# EAGLE design logger066_4ch_16APR12 (EAGLE 5.11)
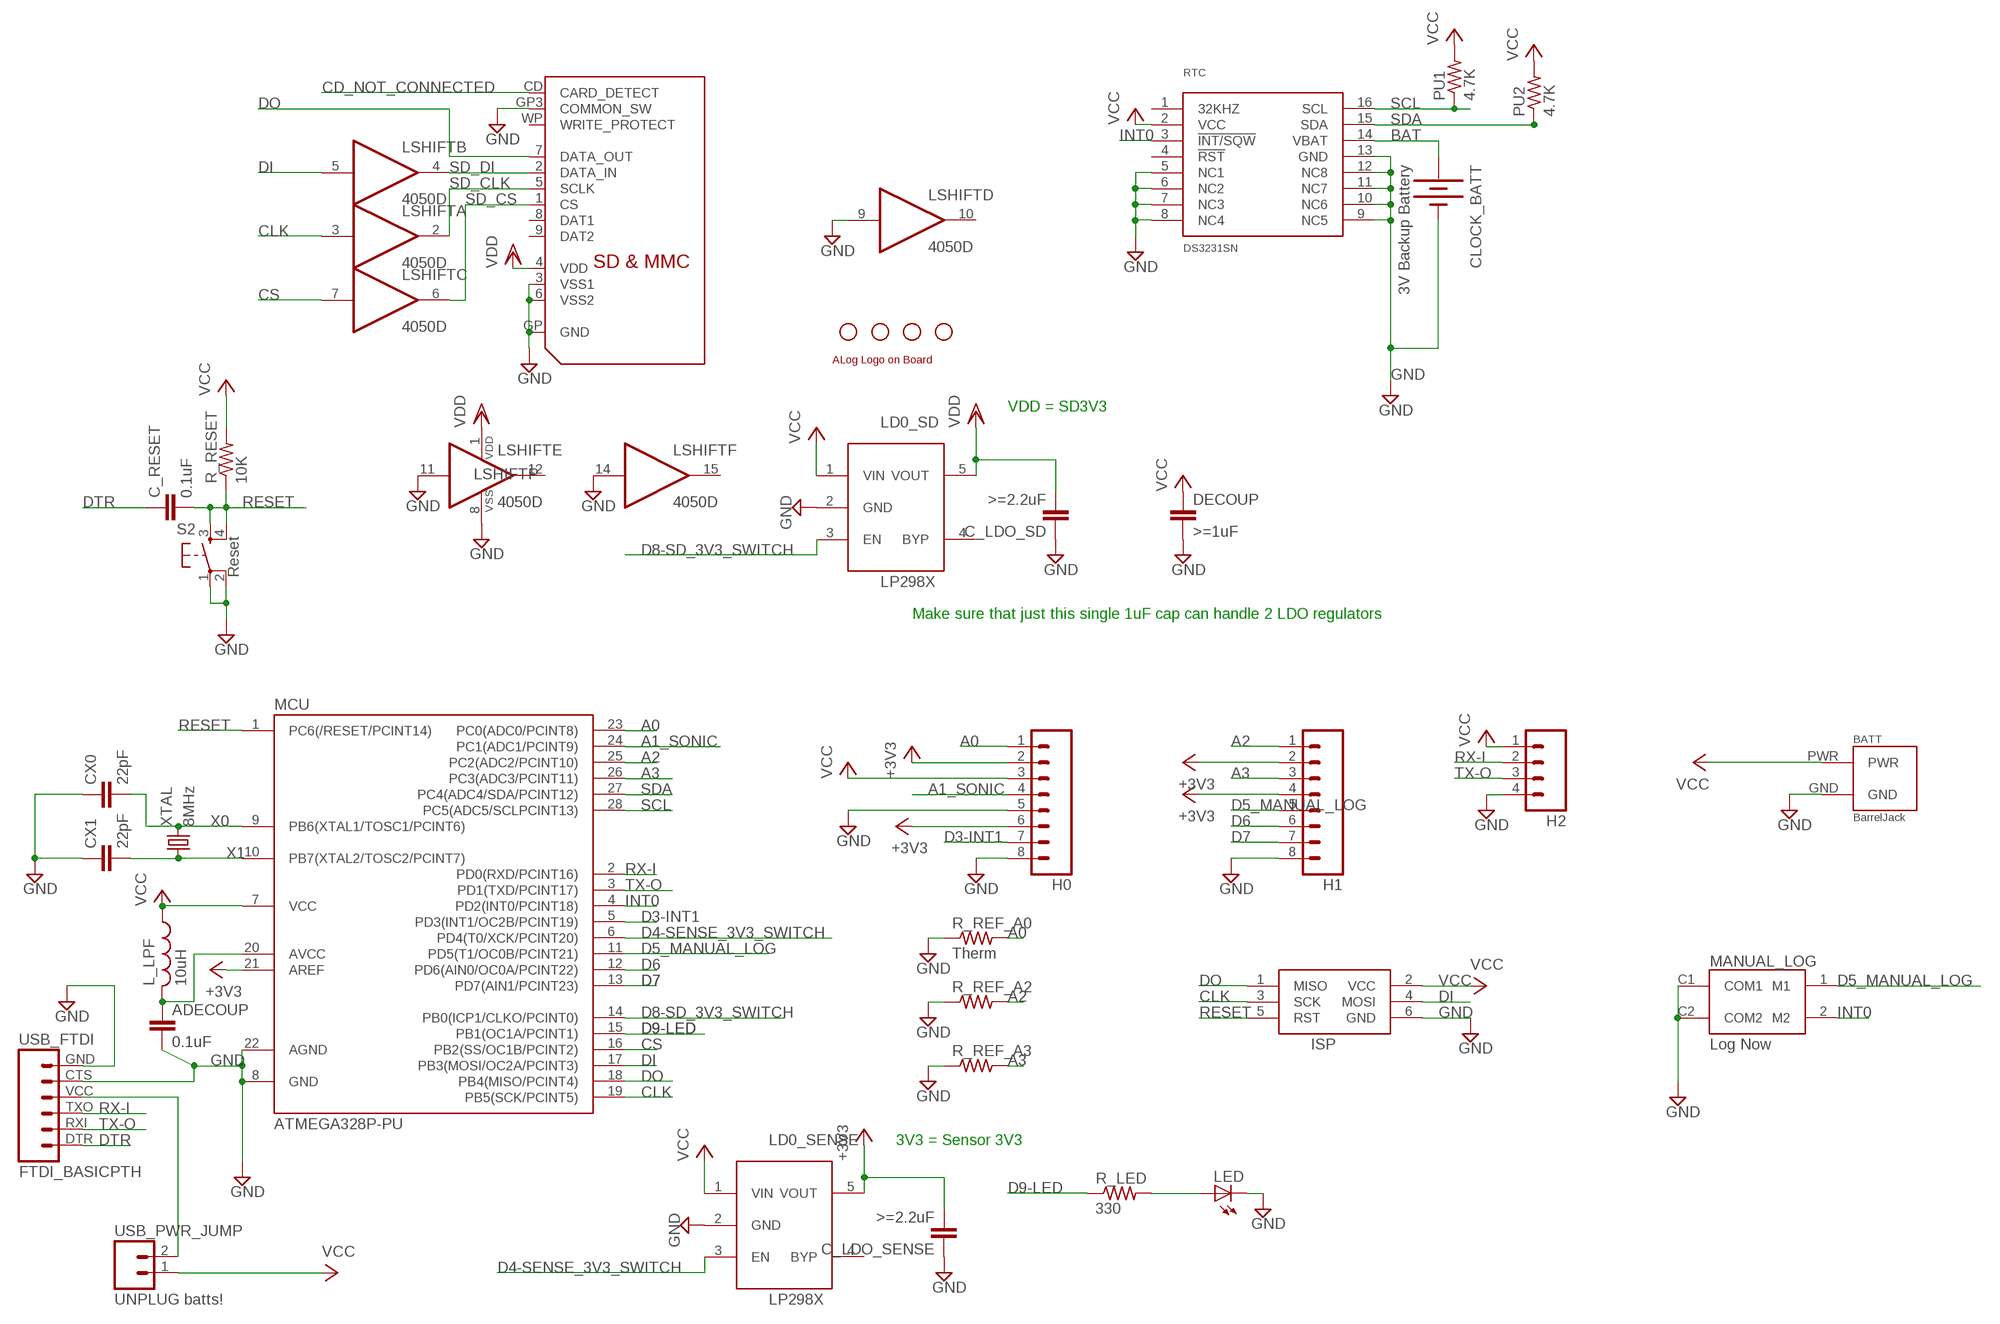
[diagram p0: schematic, sheet 1]

## Parts
ADECOUP  0.1uF  CAPPTH  [CAP-PTH-SMALL]
BATT  BarrelJack  BARREL_JACK_2.5_5.5_MM_CONN  [PJ-037B]
C_LDO_SD  >=2.2uF  CAPPTH  [CAP-PTH-SMALL]
C_LDO_SENSE  >=2.2uF  CAPPTH  [CAP-PTH-SMALL]
C_RESET  0.1uF  CAPPTH  [CAP-PTH-SMALL]
CLOCK_BATT  3V Backup Battery  BATTERY12PTH  [BATTCON_12MM_PTH]
CX0  22pF  CAPPTH  [CAP-PTH-SMALL]
CX1  22pF  CAPPTH  [CAP-PTH-SMALL]
DECOUP  >=1uF  CAPPTH  [CAP-PTH-SMALL]
H0  M083.5MM-8  [SCREWTERMINAL-3.5MM-8]
H1  M083.5MM-8  [SCREWTERMINAL-3.5MM-8]
H2  M04SCREW  [SCREWTERMINAL-3.5MM-4]
ISP  AVRISP-6  [AVRISP]
JP1  STAND-OFF  [STAND-OFF]
JP2  STAND-OFF  [STAND-OFF]
JP3  STAND-OFF  [STAND-OFF]
JP4  STAND-OFF  [STAND-OFF]
L_LPF  10uH  L-US0207/12  [0207/12]
LD0_SD  LP2985  LP298XS  [SOT23-5L]
LD0_SENSE  LP2985  LP298XS  [SOT23-5L]
LED  LED3MM  [LED3MM]
LSHIFT  4050D  [SO16]
MANUAL_LOG  Log Now  TL3350'TL3350'  [TL_BUTTON]
MCU  ATMEGA328P-PU  MEGA48/88/168-PU  [DIL28-3]
PU1  4.7K  R-US_0204/5  [0204/5]
PU2  4.7K  R-US_0204/5  [0204/5]
R_LED  330  R-US_0204/5  [0204/5]
R_REF_A0  Therm  R-US_0207/10  [0207/10]
R_REF_A2  R-US_0207/10  [0207/10]
R_REF_A3  R-US_0207/10  [0207/10]
R_RESET  10K  R-US_0204/5  [0204/5]
RTC  DS3231SN  [SO16W]
S2  Reset  TAC_SWITCHSND  [TACTILE_SWITCH_SMD]
SD  SDMMC06132  [06132]
U$2  ALOG_LOGO_V0_5.5MM  [ALOG_LOGO_V0_SMALL]
USB_FTDI  FTDI_BASICPTH  [FTDI_BASIC]
USB_PWR_JUMP  UNPLUG batts!  M02LOCK  [1X02_LOCK]
XTAL  8MHz  CRYSTALHC49UV  [HC49U-V]

## Nets
+3V3: C_LDO_SENSE.2 H0.2 H0.6 H1.2 H1.4 LD0_SENSE.5(VOUT) MCU.21(AREF)
A0: H0.1 MCU.23(PC0(ADC0/PCINT8)) R_REF_A0.2
A1_SONIC: H0.4 MCU.24(PC1(ADC1/PCINT9))
A2: H1.1 MCU.25(PC2(ADC2/PCINT10)) R_REF_A2.2
A3: H1.3 MCU.26(PC3(ADC3/PCINT11)) R_REF_A3.2
BAT: CLOCK_BATT.VCC@1(+) RTC.14(VBAT)
CD_NOT_CONNECTED: SD.CD(CARD_DETECT)
CLK: ISP.3(SCK) LSHIFT.3(A:I) MCU.19(PB5(SCK/PCINT5))
CS: LSHIFT.7(C:I) MCU.16(PB2(SS/OC1B/PCINT2))
D3-INT1: H0.7 MCU.5(PD3(INT1/OC2B/PCINT19))
D4-SENSE_3V3_SWITCH: LD0_SENSE.3(EN) MCU.6(PD4(T0/XCK/PCINT20))
D5_MANUAL_LOG: H1.5 MANUAL_LOG.1(M1) MCU.11(PD5(T1/OC0B/PCINT21))
D6: H1.6 MCU.12(PD6(AIN0/OC0A/PCINT22))
D7: H1.7 MCU.13(PD7(AIN1/PCINT23))
D8-SD_3V3_SWITCH: LD0_SD.3(EN) MCU.14(PB0(ICP1/CLKO/PCINT0))
D9-LED: MCU.15(PB1(OC1A/PCINT1)) R_LED.1
DI: ISP.4(MOSI) LSHIFT.5(B:I) MCU.17(PB3(MOSI/OC2A/PCINT3))
DO: ISP.1(MISO) MCU.18(PB4(MISO/PCINT4)) SD.7(DATA_OUT)
DTR: C_RESET.1 USB_FTDI.DTR
GND: ADECOUP.2 BATT.GND C_LDO_SD.1 C_LDO_SENSE.1 CLOCK_BATT.GND(-) CX0.1 CX1.1 DECOUP.2 H0.5 H0.8 H1.8 H2.4 ISP.6(GND) LD0_SD.2(GND) LD0_SENSE.2(GND) LED.K(C) LSHIFT.8(P:VSS) LSHIFT.9(D:I) LSHIFT.11(E:I) LSHIFT.14(F:I) MANUAL_LOG.C1(COM1) MANUAL_LOG.C2(COM2) MCU.8(GND) MCU.22(AGND) R_REF_A0.1 R_REF_A2.1 R_REF_A3.1 RTC.5(NC1) RTC.6(NC2) RTC.7(NC3) RTC.8(NC4) RTC.9(NC5) RTC.10(NC6) RTC.11(NC7) RTC.12(NC8) RTC.13(GND) S2.1 S2.2 SD.3(VSS1) SD.6(VSS2) SD.GP3(COMMON_SW) SD.GP(GND) USB_FTDI.CTS USB_FTDI.GND
INT0: MANUAL_LOG.2(M2) MCU.4(PD2(INT0/PCINT18)) RTC.3(!INT/SQW)
LED+: LED.A R_LED.2
N$1: USB_FTDI.VCC USB_PWR_JUMP.2
N$2: ADECOUP.1 L_LPF.2 MCU.20(AVCC)
RESET: C_RESET.2 ISP.5(RST) MCU.1(PC6(/RESET/PCINT14)) R_RESET.1 S2.3 S2.4
RX-I: H2.2 MCU.2(PD0(RXD/PCINT16)) USB_FTDI.TXO
SCL: MCU.28(PC5(ADC5/SCLPCINT13)) PU1.1 RTC.16(SCL)
SD_CLK: LSHIFT.2(A:O) SD.5(SCLK)
SD_CS: LSHIFT.6(C:O) SD.1(CS)
SD_DI: LSHIFT.4(B:O) SD.2(DATA_IN)
SDA: MCU.27(PC4(ADC4/SDA/PCINT12)) PU2.1 RTC.15(SDA)
TX-O: H2.3 MCU.3(PD1(TXD/PCINT17)) USB_FTDI.RXI
VCC: BATT.PWR DECOUP.1 H0.3 H2.1 ISP.2(VCC) L_LPF.1 LD0_SD.1(VIN) LD0_SENSE.1(VIN) MCU.7(VCC) PU1.2 PU2.2 R_RESET.2 RTC.2(VCC) USB_PWR_JUMP.1
VDD: C_LDO_SD.2 LD0_SD.5(VOUT) LSHIFT.1(P:VDD) SD.4(VDD)
X0: CX0.2 MCU.9(PB6(XTAL1/TOSC1/PCINT6)) XTAL.2
X1: CX1.2 MCU.10(PB7(XTAL2/TOSC2/PCINT7)) XTAL.1
Unconnected: LD0_SD.4(BYP) LD0_SENSE.4(BYP) LSHIFT.10(D:O) LSHIFT.12(E:O) LSHIFT.15(F:O) RTC.1(32KHZ) RTC.4(!RST) SD.8(DAT1) SD.9(DAT2) SD.WP(WRITE_PROTECT)

## Notes on the sheet
- VDD = SD3V3
- Make sure that just this single 1uF cap can handle 2 LDO regulators
- 3V3 = Sensor 3V3

## Library data of the parts
ADECOUP C_LDO_SD C_LDO_SENSE C_RESET CX0 CX1 DECOUP = SparkFun:CAP: Capacitor Standard 0603 ceramic capacitor, and 0.1" leaded capacitor.
BATT = awickert:BARREL_JACK_2.5_5.5_MM_CONN: Barrel Jack PJ-037B 2.5 mm ID, 6.5 mm OD Connects to plug with 2.5mm ID, 5.5mm OD Digi-Key CP-037B-ND
CLOCK_BATT = SparkFun:BATTERY: Battery Holders Various common sizes : AA, AAA, 20mm coin cell and 12mm coin cell.
H0 H1 = SparkFun:M08: Header 8 Standard 8-pin 0.1" header. Use with straight break away headers (SKU : PRT-00116), right angle break away headers (PRT-00553), swiss pins (PRT-00743), machine pins (PRT-00117), and female headers (PRT-00115).
H2 = SparkFun:M04: Header 4 Standard 4-pin 0.1" header. Use with straight break away headers (SKU : PRT-00116), right angle break away headers (PRT-00553), swiss pins (PRT-00743), machine pins (PRT-00117), and female headers (PRT-00115). Molex polarized connector foot print use with SKU : PRT-08231 with associated crimp pins and housings. 1MM SMD Version SKU: PRT-10208
ISP = adafruit:AVRISP: AVR ISP HEADER Standard 6 pin header for AVR programming
JP1-JP4 = SparkFun:STAND-OFF: Stand Off This is the mechanical footprint for a #4 phillips button head screw. Use the keepout ring to avoid running the screw head into surrounding components. SKU : PRT-00447
L_LPF = rcl:L-US: INDUCTOR, American symbol
LD0_SD LD0_SENSE = adafruit:LP298X
LED = SparkFun:LED: LEDs Standard schematic elements and footprints for 5mm, 3mm, 1206, and 0603 sized LEDs. 5mm - Spark Fun Electronics SKU : COM-00529 (and others)
LSHIFT = 40xx:4050: Hex non-inverting BUFFER
MANUAL_LOG = awickert:TL3350: Dual action (half- and full-press) button: COM1 and COM2 are connected internally. Pin 1 connects to COM1 on a half-press, and both connect on a full press.
MCU = avr-4:MEGA48/88/168-PU
PU1 PU2 R_LED R_REF_A0 R_REF_A2 R_REF_A3 R_RESET = resistor:R-US_: RESISTOR, American symbol
RTC = comfile:DS3231SN
S2 = SparkFun:TAC_SWITCH: Momentary Switch Button commonly used for reset or general input. Spark Fun Electronics SKU : COM-00097
SD = adafruit:SDMMC: SD MMC Card holder 4UCON part #06132 - easy to solder
U$2 = awickert:ALOG_LOGO_V0_5.5MM
USB_FTDI = SparkFun:FTDI_BASIC: FTDI Basic: 3.3V and 5V
USB_PWR_JUMP = SparkFun:M02: Header 2 Standard 2-pin 0.1" header. Use with straight break away headers (SKU : PRT-00116), right angle break away headers (PRT-00553), swiss pins (PRT-00743), machine pins (PRT-00117), and female headers (PRT-00115). Molex polarized connector foot print use with SKU : PRT-08233 with associated crimp pins and housings.
XTAL = SparkFun:CRYSTAL: Crystals Various standard crystals. Proven footprints. Spark Fun Electronics SKU : COM-00534

## Board
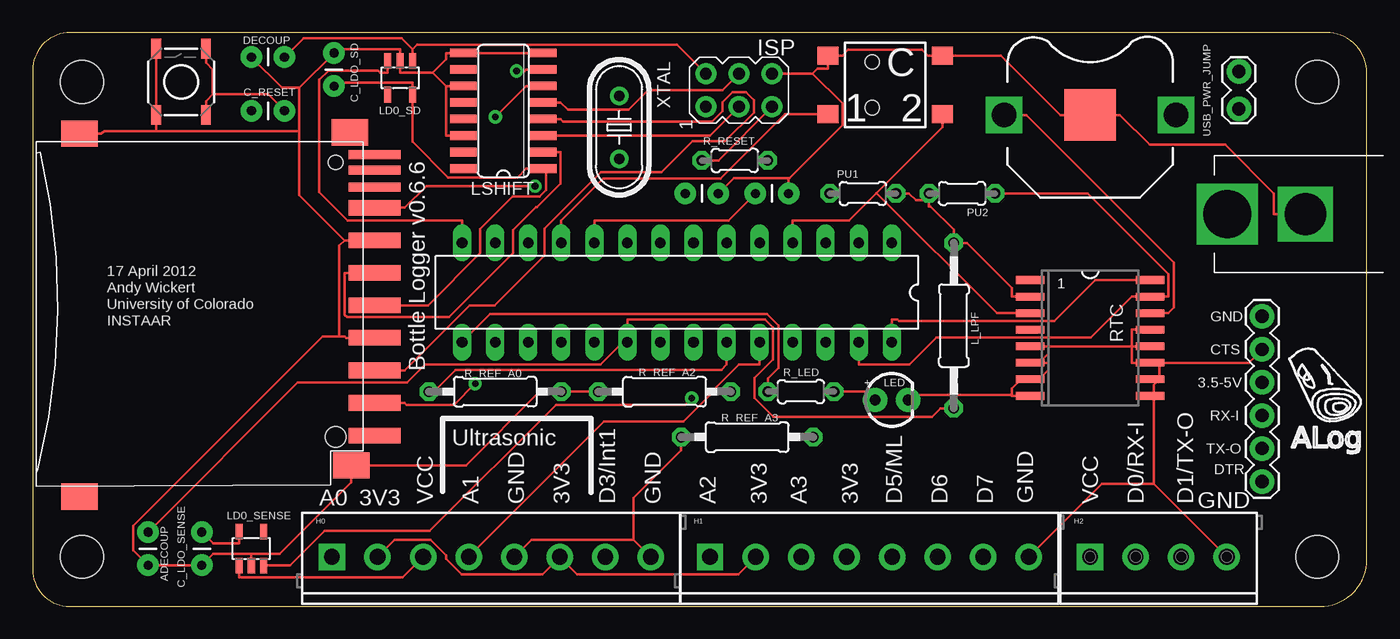
[diagram p1: board, top side]
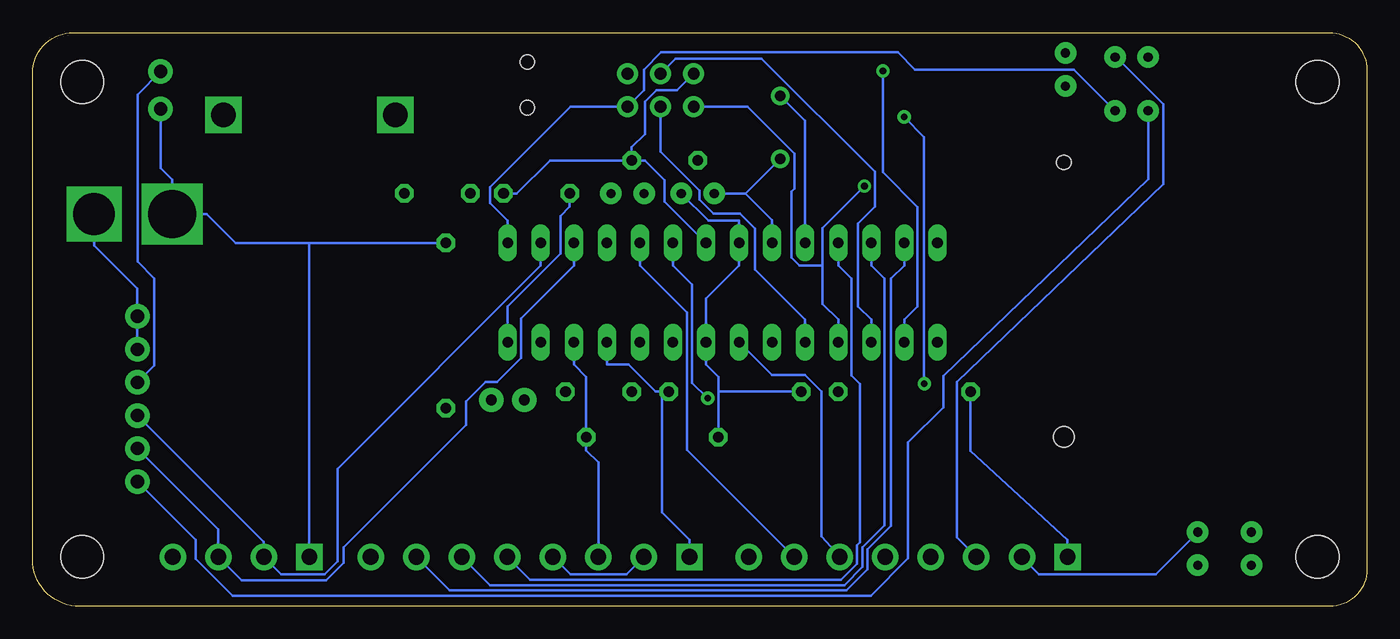
[diagram p2: board, bottom side, seen from below]

Size 102.54 x 44.12 mm. Coordinates in mm from the lower left corner, seen from the top.
Outline: 102.54,41 arc90 99.42,44.12 2.91,44.12 arc90 0,41.21 0,2.85 arc90 2.85,0 98.92,0 arc90 102.54,3.62 102.54,41
Copper layers (1*16): Top 0.035mm / dielectric 1.5mm / Bottom 0.035mm
Design rules "SparkFun": minimum track width 8mil, minimum drill 20mil, track to track 8mil, track to pad 8mil, pad to pad 8mil, via to via 8mil, smd to smd 8mil, copper to edge 10mil, drill to drill 8mil, minimum pad ring 12mil, minimum via ring 10mil, stop-mask expansion 4mil, vias tented up to drill 25mil, thermal gap 10mil

### Footprints (pad centres in the part's own frame; a part is rotated, then mirrored left to right if it is on the bottom)
CAP-PTH-SMALL = drill 0.7 pad 1.651 round: 1 0,0; 2 2.54,0
PJ-037B = drill 3.2 square: GND 6,0 | drill 3.7 square: PWR 12,0
BATTCON_12MM_PTH = smd 3.962 x 3.962: GND 0,0 | drill 1.854 square: VCC@1 -6.604,0; VCC@2 6.604,0
SCREWTERMINAL-3.5MM-8 = drill 1.2 pad 2.032 square: 1 0,0 | drill 1.2 pad 2.032 round: 2 3.5,0; 3 7,0; 4 10.5,0; 5 14,0; 6 17.5,0; 7 21,0; 8 24.5,0
SCREWTERMINAL-3.5MM-4 = drill 1.2 pad 2.032 square: 1 0,0 | drill 1.2 pad 2.032 round: 2 3.5,0; 3 7,0; 4 10.5,0
AVRISP = drill 0.9 pad 1.626 round: 1 -1.27,2.54; 2 1.27,2.54; 3 -1.27,0; 4 1.27,0; 5 -1.27,-2.54; 6 1.27,-2.54
STAND-OFF = hole 3.302: 0,0
0207/12 = drill 0.813 octagon: 1 -6.35,0; 2 6.35,0
SOT23-5L = smd 0.55 x 1.2: 1 -0.95,-1.3; 2 0,-1.3; 3 0.95,-1.3; 4 0.95,1.3; 5 -0.95,1.3
LED3MM = drill 0.813 pad 1.88 round: A -1.27,0; K 1.27,0
SO16 = smd 0.66 x 2.032: 1 -4.445,-3.073; 2 -3.175,-3.073; 3 -1.905,-3.073; 4 -0.635,-3.073; 5 0.635,-3.073; 6 1.905,-3.073; 7 3.175,-3.073; 8 4.445,-3.073; 9 4.445,3.073; 10 3.175,3.073; 11 1.905,3.073; 12 0.635,3.073; 13 -0.635,3.073; 14 -1.905,3.073; 15 -3.175,3.073; 16 -4.445,3.073
TL_BUTTON = smd 1.6 x 1.4: 1 0.8,0.7; 2 9.6,0.7; C1 0.8,5.2; C2 9.6,5.2 | hole 1.1: 4.2,1.2; 4.2,4.7
DIL28-3 = drill 0.813 long: 1 -16.51,-3.81; 2 -13.97,-3.81; 3 -11.43,-3.81; 4 -8.89,-3.81; 5 -6.35,-3.81; 6 -3.81,-3.81; 7 -1.27,-3.81; 8 1.27,-3.81; 9 3.81,-3.81; 10 6.35,-3.81; 11 8.89,-3.81; 12 11.43,-3.81; 13 13.97,-3.81; 14 16.51,-3.81; 15 16.51,3.81; 16 13.97,3.81; 17 11.43,3.81; 18 8.89,3.81; 19 6.35,3.81; 20 3.81,3.81; 21 1.27,3.81; 22 -1.27,3.81; 23 -3.81,3.81; 24 -6.35,3.81; 25 -8.89,3.81; 26 -11.43,3.81; 27 -13.97,3.81; 28 -16.51,3.81
0204/5 = drill 0.813 octagon: 1 -2.54,0; 2 2.54,0
0207/10 = drill 0.813 octagon: 1 -5.08,0; 2 5.08,0
SO16W = smd 0.6 x 2.2: 1 -4.445,-4.6; 2 -3.175,-4.6; 3 -1.905,-4.6; 4 -0.635,-4.6; 5 0.635,-4.6; 6 1.905,-4.6; 7 3.175,-4.6; 8 4.445,-4.6; 9 4.445,4.6; 10 3.175,4.6; 11 1.905,4.6; 12 0.635,4.6; 13 -0.635,4.6; 14 -1.905,4.6; 15 -3.175,4.6; 16 -4.445,4.6
TACTILE_SWITCH_SMD = smd 1.524 x 0.762: 1 -2.54,1.905; 2 2.54,1.905; 3 -2.54,-1.905; 4 2.54,-1.905
06132 = smd 1.2 x 4: 1 6.9,0.9; 2 4.4,0.9; 3 1.9,0.9; 4 -0.6,0.9; 5 -3.1,0.9; 6 -5.6,0.9; 7 -8.1,0.9; 9 9.4,0.9 | smd 0.7 x 4: 8 -9.7,0.9; CD -11,0.9; WP -12.2,0.9 | smd 2 x 2.8: GP -13.8,-21.8; GP2 14.1,-21.8; GP3 11.7,-0.9; GP4 -13.9,-1 | hole 1.1: -11.6,-2.1 | hole 1.6: 9.5,-2.1
FTDI_BASIC = drill 1.016 pad 1.88 round: CTS 10.16,0; DTR 0,0; GND 12.7,0; RXI 2.54,0; TXO 5.08,0; VCC 7.62,0
1X02_LOCK = drill 1.016 pad 1.88 round: 1 -0.178,0; 2 2.718,0
HC49U-V = drill 0.813 round: 1 -2.413,0; 2 2.413,0

### Placement (x,y rotation side)
ADECOUP  8.88,5.71 270 top
BATT  103.81,30.16 180 top
C_LDO_SD  23.17,42.55 270 top
C_LDO_SENSE  13.01,3.17 90 top
C_RESET  16.82,38.1 0 top
CLOCK_BATT  81.27,37.78 0 top
CX0  52.7,31.75 180 top
CX1  58.09,31.75 180 top
DECOUP  19.36,42.23 180 top
H0  23.01,3.81 0 top
H1  52.06,3.81 0 top
H2  81.27,3.81 0 top
ISP  54.28,39.69 90 top
JP1  3.8,3.81 0 top
JP2  98.73,40.32 90 top
JP3  98.73,3.81 90 top
JP4  3.8,40.32 0 top
L_LPF  70.79,21.59 270 top
LD0_SD  28.25,40.64 180 top
LD0_SENSE  16.82,4.45 0 top
LED  66.03,15.88 0 top
LSHIFT  36.19,38.1 90 top
MANUAL_LOG  60.32,37.15 0 top
MCU  49.52,24.13 180 top
PU1  63.81,31.75 0 top
PU2  71.43,31.75 180 top
R_LED  59.05,16.51 0 top
R_REF_A0  35.55,16.51 180 top
R_REF_A2  48.57,16.51 0 top
R_REF_A3  54.92,13.02 0 top
R_RESET  53.97,34.29 0 top
RTC  81.27,20.64 270 top
S2  11.42,40.32 90 top
SD  25.39,22.54 270 top
U$2  96.51,11.75 0 top
USB_FTDI  94.48,9.6 90 top
USB_PWR_JUMP  92.7,38.42 90 top
XTAL  45.08,36.83 270 top

### Tracks (layer width: path | path; a pad name or v marks a point on that pad's centre or on a via)
+3V3
  Top 0.203: LD0_SENSE.5 15.87,4.84 13.88,4.84 C_LDO_SENSE.2 | H1.2 54.24,2.49 41.84,2.49 H0.6 39.18,2.47 32.97,2.47 31.76,3.68 31.76,3.94 30.57,5.13 27.84,5.13 H0.2
  Bottom 0.203: H0.2 25.19,2.49 16.23,2.49 C_LDO_SENSE.2 | H1.4 61.21,2.46 56.91,2.46 H1.2 | H0.6 41.9,5.4 41.9,16.51 43.17,17.78 45.71,17.78 MCU.21
A0
  Top 0.203: MCU.23 53.33,18.59 52.92,18.19 32.53,18.19 30.85,16.51 R_REF_A0.2
  Bottom 0.203: H0.1 23.01,5.13 30.47,11.95 R_REF_A0.2
A1_SONIC
  Top 0.203: H0.4 43.93,14.23 50.03,14.23 52.02,16.23 52.02,16.35 54.27,18.59 55.87,18.59 MCU.24
A2
  Bottom 0.203: H1.1 52.06,5.13 54.16,7.23 54.16,16.51 | 54.16,16.51 54.66,16.51 56.75,18.59 58.41,18.59 MCU.25 | 54.16,16.51 R_REF_A2.2
A3
  Bottom 0.203: MCU.26 60.95,18.59 60,17.64 R_REF_A3.2 60,12 59.06,11.06 H1.3
BAT
  Top 0.203: CLOCK_BATT.VCC@1 76.36,37.78 87.7,26.45 87.7,22.96 87.27,22.54 RTC.14
CLK
  Top 0.203: ISP.3 52.06,36.2 LSHIFT.3
  Bottom 0.203: MCU.19 43.17,22.05 47.03,25.91 47.03,29.04 48.19,30.2 50.23,30.2 51.29,31.26 51.29,31.96 54.28,34.96 ISP.3
CS  (via drill 0.51 pad 1.02)
  Top 0.203: LSHIFT.7 37.94,41.27 37.82,41.16 v37.2,41.16
  Bottom 0.203: MCU.16 35.55,22.05 34.53,23.06 34.53,30.71 37.2,33.38 v37.2,41.16
D3-INT1
  Bottom 0.203: H0.7 52.25,12.05 52.25,22.6 55.87,26.21 MCU.5
D4-SENSE_3V3_SWITCH  (via drill 0.51 pad 1.02)
  Top 0.203: v50.66,16.01 50.14,15.49 40.22,15.49 30.52,5.79 22.44,5.79 19.79,3.15 LD0_SENSE.3
  Bottom 0.203: v50.66,16.01 51.85,17.2 51.85,24.73 53.33,26.21 MCU.6
D5_MANUAL_LOG
  Top 0.203: MCU.11 40.63,29.67 43.84,32.88 52.87,32.88 57.83,37.85 MANUAL_LOG.1
  Bottom 0.203: MCU.11 40.63,26.21 39.61,25.2 39.61,17.75 38.95,17.09 38.95,4.94 39.18,4.71 39.18,3.27 40.41,2.05 64.3,2.05 H1.5
D6
  Bottom 0.203: H1.6 67.39,1.64 40.16,1.64 38.78,3.03 38.78,4.54 37.07,6.25 37.07,25.2 38.09,26.21 MCU.12
D7
  Bottom 0.203: H1.7 70.49,1.24 40,1.24 38.37,2.86 38.37,4.38 36.57,6.18 36.57,25.2 35.55,26.21 MCU.13
D8-SD_3V3_SWITCH
  Top 0.203: LD0_SD.3 27.3,41.03 26.72,41.03 26.55,41.2 22.74,41.2 22.02,40.48 22.02,31.86 24.21,29.67 33.01,29.67 MCU.14
D9-LED
  Top 0.203: MCU.15 35.18,22.49 56.44,22.49 57.32,21.6 57.32,18.34 56.51,17.53 R_LED.1
DI
  Top 0.203: ISP.4 53.01,39.69 47.31,39.69 45.8,38.18 41.14,38.18 40.58,38.73 LSHIFT.5
  Bottom 0.203: ISP.4 53.12,42.12 46.51,42.12 37.8,33.41 37.8,30.73 39.11,29.42 39.11,23.06 38.09,22.05 MCU.17
DO  (via drill 0.51 pad 1.02)
  Top 0.203: v38.62,32.31 30.26,32.31 28.59,30.64 SD.7
  Bottom 0.203: 41.83,26.21 41.83,29.09 v38.62,32.31 | 41.83,26.21 43.6,26.21 44.21,26.82 44.21,31.91 44.01,32.11 44.01,34.83 47.6,38.42 ISP.1 | 41.83,26.21 41.83,23.25 40.63,22.05 MCU.18
DTR
  Bottom 0.203: USB_FTDI.DTR 90.02,5.14 90.02,3.67 87.17,0.82 38.12,0.82 35.27,3.68 35.27,12.61 32.57,15.31 32.57,17.72 16.82,32.83 C_RESET.1
GND
  Top 0.203: 16.82,4.05 13.88,4.05 C_LDO_SENSE.1 ADECOUP.2 7.74,4.31 7.74,6.19 22.3,20.74 23.58,20.74 | 23.58,20.74 23.98,20.74 24.09,20.64 SD.3 | 23.98,28.14 23.58,27.74 23.58,20.74 | 20.49,39.87 C_LDO_SD.1 23.47,42.84 28.25,42.84 LD0_SD.2 28.25,41.03 30.76,41.03 | 20.49,36.55 20.49,39.87 | 20.49,39.87 19.18,39.87 DECOUP.2 | 20.49,36.55 9.52,36.55 | 23.98,28.14 20.49,31.64 20.49,36.55 | 16.82,4.05 19,4.05 24.49,9.54 SD.GP3 33.31,10.84 38.98,16.51 R_REF_A0.1 R_REF_A2.1 | 16.82,4.05 LD0_SENSE.2 | 9.52,36.55 5.5,36.55 5.29,36.34 SD.GP | 9.52,36.55 9.52,36.72 S2.1 9.52,41.8 S2.2 | 59.95,40.96 ISP.6 | 23.98,28.14 SD.6 | 86.15,9.43 H2.4 | 86.15,16.19 86.15,9.43 | 86.15,9.43 82.18,9.43 H1.8 | 75.27,16.27 75.27,16.19 RTC.8 | 75.27,16.27 67.7,16.27 LED.K | 75.27,16.27 75.27,16.76 75.97,17.46 RTC.7 77.02,17.46 77.37,17.46 78.07,18.16 78.07,18.73 77.37,18.73 | 86.57,18.73 87.27,18.73 93.45,18.73 USB_FTDI.CTS | 86.57,18.73 RTC.11 84.46,18.73 84.46,20 | 86.57,18.73 86.57,17.46 | 86.57,17.46 86.15,17.04 86.15,16.19 | 86.57,17.46 RTC.10 | 86.15,16.19 RTC.9 | BATT.GND 95.4,30.16 95.4,31.75 91.65,35.5 85.84,35.5 83.56,37.78 CLOCK_BATT.GND 78.98,37.78 74.42,42.35 MANUAL_LOG.C2 68.81,42.35 68.35,42.8 62.68,42.8 62.22,42.35 MANUAL_LOG.C1 61.12,41.34 60.33,41.34 59.95,40.96 | 58.09,32.94 58.17,32.94 62.22,37 62.22,38.68 59.95,40.96 | R_REF_A3.1 49.84,12 46.19,8.36 46.19,5.13 | 46.19,5.13 H0.8 | H0.5 38.34,5.13 46.19,5.13 | 30.76,41.03 31.79,42.06 31.79,42.55 LSHIFT.9 LSHIFT.8 | 30.76,41.03 31.79,40.01 | LSHIFT.14 31.79,36.2 31.79,40.01 | 31.79,40.01 LSHIFT.11 | 84.46,20 RTC.12 | 84.46,20 78.07,20 | 84.46,20 84.46,21.27 RTC.13
  Top 0.203: CX0.1 53.89,32.94 58.09,32.94 | 58.09,32.94 CX1.1 | 78.07,20 RTC.5 | 77.37,18.73 78.07,19.43 78.07,20 | 77.37,18.73 RTC.6
  Bottom 0.203: 49.84,16.51 R_REF_A3.1 | 49.84,16.51 49.84,17.64 50.79,18.59 MCU.22 50.79,23.67 48.25,26.21 MCU.8 48.25,29.67 50.61,29.67 CX0.1 | 49.84,16.51 44.5,16.51 R_REF_A2.1 | USB_FTDI.CTS USB_FTDI.GND 94.48,24.42 97.81,27.75 BATT.GND
INT0
  Top 0.203: 64.86,31.79 69.91,36.84 MANUAL_LOG.2 | 64.86,31.79 62.74,29.67 58.41,29.67 MCU.4 | RTC.3 74.1,22.54 64.86,31.79
LED+
  Top 0.203: R_LED.2 64.12,16.51 LED.A
N$1
  Bottom 0.203: USB_PWR_JUMP.2 94.48,39.36 94.48,26.5 93.19,25.22 93.19,18.52 USB_FTDI.VCC
N$2
  Top 0.203: 45.71,20.66 43.64,18.59 30.16,18.59 28.78,17.22 20.38,17.22 ADECOUP.1 | 45.71,20.66 45.71,22.05 56.3,22.05 56.91,21.43 56.91,19 55.48,17.57 55.48,16.04 56.93,14.59 69.12,14.59 69.78,15.24 L_LPF.2 | 45.71,20.66 MCU.20
RESET
  Top 0.203: 13.85,39.37 18.09,39.37 C_RESET.2 | 13.85,39.37 13.33,38.85 S2.3 | 13.85,39.37 13.85,41.27 13.33,41.8 S2.4 | R_RESET.1 52.7,34.29 ISP.5
  Bottom 0.203: C_RESET.2 22.53,41.27 34.73,41.27 36.05,42.6 54.23,42.6 55.55,41.28 55.55,39.69 ISP.5 61.19,38.42 67.38,32.23 67.38,31.01 66.03,29.67 MCU.1
RX-I
  Bottom 0.203: USB_FTDI.TXO 84.77,4.97 H2.2 83.45,2.49 80.09,2.49 79.11,3.47 79.11,10.59 63.49,26.21 MCU.2
SCL
  Top 0.203: MCU.28 66.03,22.05 66.45,22.05 66.56,21.94 78.51,21.94 81.65,25.08 RTC.16
  Bottom 0.203: PU1.1 61.27,30.73 61.99,30.02 61.99,27.11 66.03,23.07 MCU.28
SD_CLK
  Top 0.203: SD.5 23.98,25.64 23.98,22.42 24.17,22.23 31.99,22.23 36.93,27.17 36.93,28.94 38.68,30.69 38.77,30.69 40.58,32.49 40.58,34.92 LSHIFT.2
SD_CS  (via drill 0.51 pad 1.02)
  Top 0.203: v34.02,17.13 32.38,15.49 28.74,15.49 28.59,15.64 SD.1 | v35.56,37.63 37.94,40.01 LSHIFT.6
  Bottom 0.203: v35.56,37.63 34.03,36.09 34.03,17.14 v34.02,17.13
SD_DI
  Top 0.203: LSHIFT.4 40.58,37.47 40.76,37.29 52.22,37.29 53.01,38.08 53.01,38.76 53.79,39.54 54.81,39.54 55.42,38.93 55.42,37.96 53.22,35.76 50.73,35.76 48.34,33.37 43.69,33.37 39.36,29.04 39.36,26.99 35.5,23.13 33.58,23.13 28.59,18.14 SD.2
SDA
  Top 0.203: PU2.1 81.08,31.75 87.27,25.55 87.27,23.81 RTC.15 85.27,23.81 84.46,23.81 81.32,20.67 69.44,20.67 67.37,18.59 63.49,18.59 MCU.27
TX-O
  Bottom 0.203: USB_FTDI.RXI 88.27,5.93 H2.3 86.48,2.02 79.96,2.02 78.63,3.35 78.63,4.54 69.24,13.94 69.24,15.76 67.73,17.27 66.83,17.27 65.01,19.09 65.01,22.15 60.95,26.21 MCU.3
VCC
  Top 0.203: LD0_SENSE.1 15.87,2.24 28.44,2.24 H0.3 | DECOUP.1 20.81,43.68 28.36,43.68 29.2,42.84 | ISP.2 49.52,43.18 29.53,43.18 29.2,42.84 | 29.2,42.84 LD0_SD.1 | PU1.2 67.36,31.75 67.87,31.24 68.89,31.24 | 68.89,31.24 68.89,30.73 69.02,30.73 70.79,28.96 L_LPF.1 71.81,27.94 75.27,24.48 75.27,23.81 RTC.2 | 68.89,31.24 PU2.2
  Bottom 0.203: DECOUP.1 19.26,42.23 15.65,38.62 15.65,32.48 31.51,17.26 31.51,5.3 H0.3 | R_RESET.2 55.49,34.29 53.98,32.78 53.98,31.13 MCU.7 | R_RESET.2 56.51,35.31 55.49,36.32 55.49,38.81 54.61,39.69 53.01,39.69 ISP.2 | R_RESET.2 62.79,34.29 65.33,31.75 PU1.2 | 81.27,27.94 86.93,27.94 89.15,30.16 BATT.PWR 91.81,32.83 92.7,33.71 USB_PWR_JUMP.1 | L_LPF.1 81.27,27.94 | 81.27,27.94 H2.1
VDD
  Top 0.203: C_LDO_SD.2 23.41,40.24 29.2,40.24 LD0_SD.5 29.2,35.73 31.94,32.98 37.26,32.98 37.94,33.66 LSHIFT.1 39.45,33.47 39.45,31.99 38.95,31.5 36.87,31.5 34.39,29.02 34.39,27.15 30.39,23.14 SD.4
X0
  Bottom 0.203: 47.74,31.75 CX0.2 | 47.74,31.75 XTAL.2 | MCU.9 45.71,29.72 47.74,31.75
X1
  Top 0.203: MCU.10 43.17,29.67 53.47,29.67 CX1.2
  Bottom 0.203: XTAL.1 43.17,37.34 MCU.10

### Text on the board
tPlace: 17 April 2012 | Andy Wickert | 1 | University of Colorado | INSTAAR | GND | CTS | Bottle Logger v0.6.6 | + | 3.5-5V | RX-I | Ultrasonic | TX-O | DTR | A0 | 3V3 | VCC | A1 | GND | 3V3 | D3/Int1 | GND | A2 | 3V3 | A3 | 3V3 | D5/ML | D6 | D7 | GND | VCC | D0/RX-I | D1/TX-O | GND